# Altium schematic sheet PLWD_TOP_V3.SchDoc
size A4; SheetNumber: 1; SheetTotal: 10
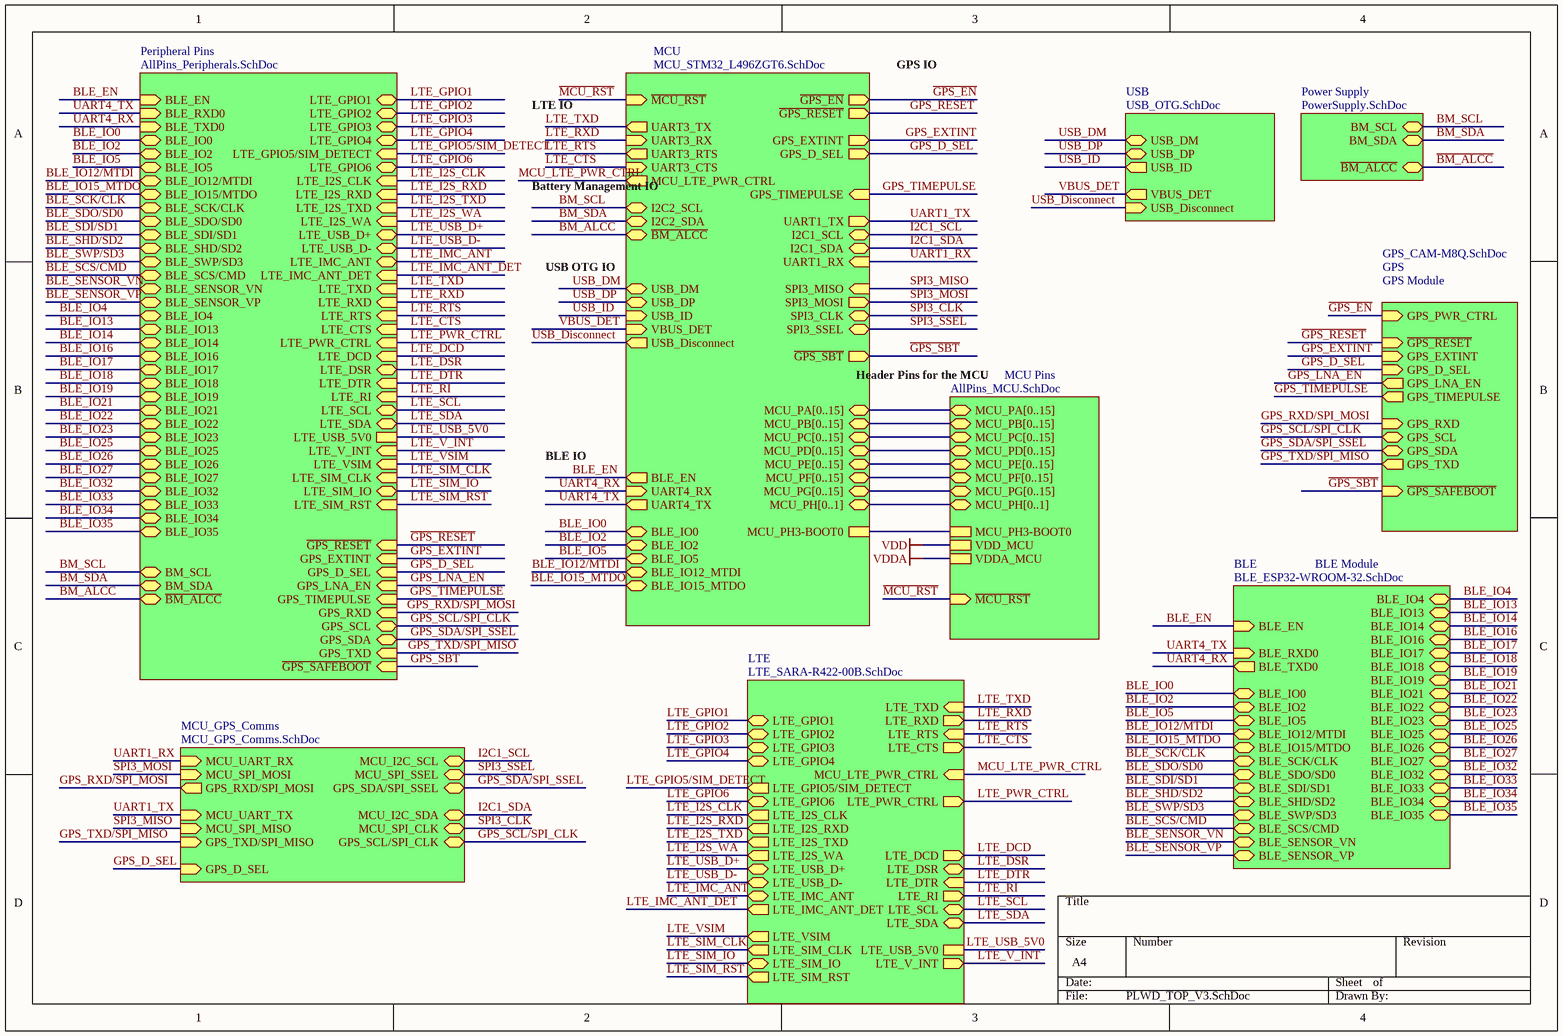
[diagram p0: PLWD_TOP_V3.SchDoc]

## Sub-sheets
BLE = BLE_ESP32-WROOM-32.SchDoc: BLE_EN (in), BLE_RXD0 (in), BLE_TXD0 (out), BLE_IO0 (bidir), BLE_IO2 (bidir), BLE_IO5 (bidir), BLE_IO12/MTDI (bidir), BLE_IO15/MTDO (bidir), BLE_SCK/CLK (bidir), BLE_SDO/SD0 (bidir), BLE_SDI/SD1 (bidir), BLE_SHD/SD2 (bidir), BLE_SWP/SD3 (bidir), BLE_SCS/CMD (bidir), BLE_SENSOR_VN (bidir), BLE_SENSOR_VP (bidir), BLE_IO4 (bidir), BLE_IO13 (bidir), BLE_IO14 (bidir), BLE_IO16 (bidir), BLE_IO17 (bidir), BLE_IO18 (bidir), BLE_IO27 (bidir), BLE_IO26 (bidir), BLE_IO25 (bidir), BLE_IO23 (bidir), BLE_IO22 (bidir), BLE_IO21 (bidir), BLE_IO19 (bidir), BLE_IO32 (bidir), BLE_IO33 (bidir), BLE_IO34 (bidir), BLE_IO35 (bidir)
GPS = GPS_CAM-M8Q.SchDoc: GPS_PWR_CTRL (in), ~{GPS_RESET} (in), GPS_EXTINT (in), GPS_D_SEL (in), GPS_LNA_EN (out), GPS_TIMEPULSE (out), GPS_RXD (in), GPS_SCL (bidir), GPS_SDA (bidir), GPS_TXD (out), ~{GPS_SAFEBOOT} (in)
LTE = LTE_SARA-R422-00B.SchDoc: LTE_TXD (in), LTE_RXD (out), LTE_RTS (in), LTE_CTS (out), MCU_LTE_PWR_CTRL (in), LTE_GPIO1 (bidir), LTE_GPIO2 (bidir), LTE_GPIO3 (bidir), LTE_GPIO4 (bidir), LTE_GPIO5/SIM_DETECT (out), LTE_GPIO6 (bidir), LTE_I2S_CLK (out), LTE_I2S_RXD (out), LTE_I2S_TXD (out), LTE_I2S_WA (out), LTE_USB_D- (bidir), LTE_USB_D+ (bidir), LTE_IMC_ANT (bidir), LTE_IMC_ANT_DET (out), LTE_DTR (in), LTE_DSR (bidir), LTE_DCD (out), LTE_RI (out), LTE_SDA (bidir), LTE_SCL (bidir), LTE_USB_5V0, LTE_V_INT (out), LTE_VSIM (out), LTE_SIM_CLK (out), LTE_SIM_IO (bidir), LTE_SIM_RST (out), LTE_PWR_CTRL (out)
MCU = MCU_STM32_L496ZGT6.SchDoc: UART3_TX (out), UART3_RX (in), UART3_RTS (out), UART3_CTS (in), I2C2_SCL (bidir), I2C2_SDA (bidir), MCU_LTE_PWR_CTRL (out), ~{GPS_SBT} (out), UART1_TX (out), UART1_RX (in), GPS_EXTINT (out), I2C1_SCL (bidir), I2C1_SDA (bidir), GPS_TIMEPULSE (in), GPS_D_SEL (out), UART4_RX (in), UART4_TX (out), BLE_IO0 (bidir), BLE_IO2 (bidir), BLE_IO5 (bidir), BLE_IO12_MTDI (bidir), BLE_IO15_MTDO (bidir), ~{BM_ALCC} (bidir), ~{GPS_RESET} (out), BLE_EN (out), ~{GPS_EN} (out), SPI3_MISO (in), SPI3_MOSI (out), SPI3_CLK (bidir), SPI3_SSEL (bidir), USB_DM (bidir), USB_DP (bidir), MCU_PA[0..15] (bidir), MCU_PB[0..15] (bidir), MCU_PC[0..15] (bidir), MCU_PD[0..15] (bidir), MCU_PE[0..15] (bidir), MCU_PF[0..15] (bidir), MCU_PG[0..15] (bidir), MCU_PH3-BOOT0, MCU_PH[0..1] (bidir), ~{MCU_RST} (in), USB_ID (in), VBUS_DET (in), USB_Disconnect (out)
MCU Pins = AllPins_MCU.SchDoc: MCU_PA[0..15] (bidir), MCU_PB[0..15] (bidir), MCU_PC[0..15] (bidir), MCU_PD[0..15] (bidir), MCU_PE[0..15] (bidir), MCU_PF[0..15] (bidir), MCU_PG[0..15] (bidir), MCU_PH[0..1] (bidir), MCU_PH3-BOOT0, VDD_MCU, VDDA_MCU, ~{MCU_RST} (in)
MCU_GPS_Comms = MCU_GPS_Comms.SchDoc: MCU_UART_RX (in), MCU_SPI_MOSI (in), GPS_D_SEL (in), GPS_RXD/SPI_MOSI (out), MCU_UART_TX (in), MCU_SPI_MISO (in), GPS_TXD/SPI_MISO (in), GPS_SDA/SPI_SSEL (bidir), MCU_SPI_SSEL (bidir), MCU_I2C_SCL (bidir), GPS_SCL/SPI_CLK (bidir), MCU_SPI_CLK (bidir), MCU_I2C_SDA (bidir)
Peripheral Pins = AllPins_Peripherals.SchDoc: BLE_EN (in), BLE_RXD0 (in), BLE_TXD0 (in), BLE_IO0 (bidir), BLE_IO2 (bidir), BLE_IO5 (bidir), BLE_IO12/MTDI (bidir), BLE_IO15/MTDO (bidir), BLE_SCK/CLK (bidir), BLE_SDO/SD0 (bidir), BLE_SDI/SD1 (bidir), BLE_SHD/SD2 (bidir), BLE_SWP/SD3 (bidir), BLE_SCS/CMD (bidir), BLE_SENSOR_VN (bidir), BLE_SENSOR_VP (bidir), BLE_IO4 (bidir), BLE_IO13 (bidir), BLE_IO14 (bidir), BLE_IO16 (bidir), BLE_IO17 (bidir), BLE_IO18 (bidir), BLE_IO19 (bidir), BLE_IO21 (bidir), BLE_IO22 (bidir), BLE_IO23 (bidir), BLE_IO25 (bidir), BLE_IO26 (bidir), BLE_IO27 (bidir), BLE_IO32 (bidir), BLE_IO33 (bidir), BLE_IO34 (bidir), BLE_IO35 (bidir), LTE_IMC_ANT_DET (in), LTE_I2S_RXD (in), LTE_I2S_CLK (in), LTE_GPIO6 (bidir), LTE_GPIO5/SIM_DETECT (in), LTE_GPIO4 (bidir), LTE_GPIO3 (bidir), LTE_GPIO2 (bidir), LTE_GPIO1 (bidir), LTE_I2S_TXD (in), LTE_I2S_WA (in), LTE_USB_D+ (bidir), LTE_USB_D- (bidir), LTE_IMC_ANT (bidir), LTE_TXD (in), LTE_RXD (in), LTE_RTS (in), LTE_CTS (in), LTE_PWR_CTRL (in), LTE_DCD (in), LTE_DSR (bidir), LTE_DTR (in), LTE_RI (in), ~{GPS_RESET} (in), GPS_EXTINT (in), GPS_D_SEL (in), GPS_LNA_EN (in), GPS_TIMEPULSE (in), GPS_RXD (in), GPS_TXD (in), GPS_SCL (bidir), GPS_SDA (bidir), BM_SCL (bidir), BM_SDA (bidir), ~{BM_ALCC} (bidir), ~{GPS_SAFEBOOT} (in), LTE_USB_5V0, LTE_SDA (bidir), LTE_SCL (bidir), LTE_V_INT (in), LTE_SIM_CLK (in), LTE_VSIM (in), LTE_SIM_RST (in), LTE_SIM_IO (bidir)
Power Supply = PowerSupply.SchDoc: BM_SCL (bidir), BM_SDA (bidir), ~{BM_ALCC} (bidir)
USB = USB_OTG.SchDoc: USB_DM (bidir), USB_DP (bidir), USB_ID (out), VBUS_DET (out), USB_Disconnect (in)

## Nets
VDD: sheet MCU Pins/VDD_MCU
VDDA: sheet MCU Pins/VDDA_MCU
~{BM_ALCC}: sheet MCU/~{BM_ALCC}, sheet Power Supply/~{BM_ALCC}, sheet Peripheral Pins/~{BM_ALCC}
BLE_EN: sheet MCU/BLE_EN, sheet BLE/BLE_EN, sheet Peripheral Pins/BLE_EN
BLE_IO0: sheet MCU/BLE_IO0, sheet BLE/BLE_IO0, sheet Peripheral Pins/BLE_IO0
BLE_IO2: sheet MCU/BLE_IO2, sheet BLE/BLE_IO2, sheet Peripheral Pins/BLE_IO2
BLE_IO4: sheet BLE/BLE_IO4, sheet Peripheral Pins/BLE_IO4
BLE_IO5: sheet MCU/BLE_IO5, sheet BLE/BLE_IO5, sheet Peripheral Pins/BLE_IO5
BLE_IO12/MTDI: sheet MCU/BLE_IO12_MTDI, sheet BLE/BLE_IO12/MTDI, sheet Peripheral Pins/BLE_IO12/MTDI
BLE_IO13: sheet BLE/BLE_IO13, sheet Peripheral Pins/BLE_IO13
BLE_IO14: sheet BLE/BLE_IO14, sheet Peripheral Pins/BLE_IO14
BLE_IO15_MTDO: sheet MCU/BLE_IO15_MTDO, sheet BLE/BLE_IO15/MTDO, sheet Peripheral Pins/BLE_IO15/MTDO
BLE_IO16: sheet BLE/BLE_IO16, sheet Peripheral Pins/BLE_IO16
BLE_IO17: sheet BLE/BLE_IO17, sheet Peripheral Pins/BLE_IO17
BLE_IO18: sheet BLE/BLE_IO18, sheet Peripheral Pins/BLE_IO18
BLE_IO19: sheet BLE/BLE_IO19, sheet Peripheral Pins/BLE_IO19
BLE_IO21: sheet BLE/BLE_IO21, sheet Peripheral Pins/BLE_IO21
BLE_IO22: sheet BLE/BLE_IO22, sheet Peripheral Pins/BLE_IO22
BLE_IO23: sheet BLE/BLE_IO23, sheet Peripheral Pins/BLE_IO23
BLE_IO25: sheet BLE/BLE_IO25, sheet Peripheral Pins/BLE_IO25
BLE_IO26: sheet BLE/BLE_IO26, sheet Peripheral Pins/BLE_IO26
BLE_IO27: sheet BLE/BLE_IO27, sheet Peripheral Pins/BLE_IO27
BLE_IO32: sheet BLE/BLE_IO32, sheet Peripheral Pins/BLE_IO32
BLE_IO33: sheet BLE/BLE_IO33, sheet Peripheral Pins/BLE_IO33
BLE_IO34: sheet BLE/BLE_IO34, sheet Peripheral Pins/BLE_IO34
BLE_IO35: sheet BLE/BLE_IO35, sheet Peripheral Pins/BLE_IO35
BLE_SCK/CLK: sheet BLE/BLE_SCK/CLK, sheet Peripheral Pins/BLE_SCK/CLK
BLE_SCS/CMD: sheet BLE/BLE_SCS/CMD, sheet Peripheral Pins/BLE_SCS/CMD
BLE_SDI/SD1: sheet BLE/BLE_SDI/SD1, sheet Peripheral Pins/BLE_SDI/SD1
BLE_SDO/SD0: sheet BLE/BLE_SDO/SD0, sheet Peripheral Pins/BLE_SDO/SD0
BLE_SENSOR_VN: sheet BLE/BLE_SENSOR_VN, sheet Peripheral Pins/BLE_SENSOR_VN
BLE_SENSOR_VP: sheet BLE/BLE_SENSOR_VP, sheet Peripheral Pins/BLE_SENSOR_VP
BLE_SHD/SD2: sheet BLE/BLE_SHD/SD2, sheet Peripheral Pins/BLE_SHD/SD2
BLE_SWP/SD3: sheet BLE/BLE_SWP/SD3, sheet Peripheral Pins/BLE_SWP/SD3
BM_SCL: sheet MCU/I2C2_SCL, sheet Power Supply/BM_SCL, sheet Peripheral Pins/BM_SCL
BM_SDA: sheet MCU/I2C2_SDA, sheet Power Supply/BM_SDA, sheet Peripheral Pins/BM_SDA
~{GPS_EN}: sheet MCU/~{GPS_EN}, sheet GPS/GPS_PWR_CTRL
~{GPS_RESET}: sheet MCU/~{GPS_RESET}, sheet GPS/~{GPS_RESET}, sheet Peripheral Pins/~{GPS_RESET}
~{GPS_SBT}: sheet MCU/~{GPS_SBT}, sheet GPS/~{GPS_SAFEBOOT}, sheet Peripheral Pins/~{GPS_SAFEBOOT}
GPS_D_SEL: sheet MCU/GPS_D_SEL, sheet GPS/GPS_D_SEL, sheet Peripheral Pins/GPS_D_SEL, sheet MCU_GPS_Comms/GPS_D_SEL
GPS_EXTINT: sheet MCU/GPS_EXTINT, sheet GPS/GPS_EXTINT, sheet Peripheral Pins/GPS_EXTINT
GPS_LNA_EN: sheet GPS/GPS_LNA_EN, sheet Peripheral Pins/GPS_LNA_EN
GPS_RXD/SPI_MOSI: sheet GPS/GPS_RXD, sheet Peripheral Pins/GPS_RXD, sheet MCU_GPS_Comms/GPS_RXD/SPI_MOSI
GPS_SCL/SPI_CLK: sheet GPS/GPS_SCL, sheet Peripheral Pins/GPS_SCL, sheet MCU_GPS_Comms/GPS_SCL/SPI_CLK
GPS_SDA/SPI_SSEL: sheet GPS/GPS_SDA, sheet Peripheral Pins/GPS_SDA, sheet MCU_GPS_Comms/GPS_SDA/SPI_SSEL
GPS_TIMEPULSE: sheet MCU/GPS_TIMEPULSE, sheet GPS/GPS_TIMEPULSE, sheet Peripheral Pins/GPS_TIMEPULSE
GPS_TXD/SPI_MISO: sheet GPS/GPS_TXD, sheet Peripheral Pins/GPS_TXD, sheet MCU_GPS_Comms/GPS_TXD/SPI_MISO
I2C1_SCL: sheet MCU/I2C1_SCL, sheet MCU_GPS_Comms/MCU_I2C_SCL
I2C1_SDA: sheet MCU/I2C1_SDA, sheet MCU_GPS_Comms/MCU_I2C_SDA
LTE_CTS: sheet MCU/UART3_CTS, sheet LTE/LTE_CTS, sheet Peripheral Pins/LTE_CTS
LTE_DCD: sheet LTE/LTE_DCD, sheet Peripheral Pins/LTE_DCD
LTE_DSR: sheet LTE/LTE_DSR, sheet Peripheral Pins/LTE_DSR
LTE_DTR: sheet LTE/LTE_DTR, sheet Peripheral Pins/LTE_DTR
LTE_GPIO1: sheet LTE/LTE_GPIO1, sheet Peripheral Pins/LTE_GPIO1
LTE_GPIO2: sheet LTE/LTE_GPIO2, sheet Peripheral Pins/LTE_GPIO2
LTE_GPIO3: sheet LTE/LTE_GPIO3, sheet Peripheral Pins/LTE_GPIO3
LTE_GPIO4: sheet LTE/LTE_GPIO4, sheet Peripheral Pins/LTE_GPIO4
LTE_GPIO5/SIM_DETECT: sheet LTE/LTE_GPIO5/SIM_DETECT, sheet Peripheral Pins/LTE_GPIO5/SIM_DETECT
LTE_GPIO6: sheet LTE/LTE_GPIO6, sheet Peripheral Pins/LTE_GPIO6
LTE_I2S_CLK: sheet LTE/LTE_I2S_CLK, sheet Peripheral Pins/LTE_I2S_CLK
LTE_I2S_RXD: sheet LTE/LTE_I2S_RXD, sheet Peripheral Pins/LTE_I2S_RXD
LTE_I2S_TXD: sheet LTE/LTE_I2S_TXD, sheet Peripheral Pins/LTE_I2S_TXD
LTE_I2S_WA: sheet LTE/LTE_I2S_WA, sheet Peripheral Pins/LTE_I2S_WA
LTE_IMC_ANT: sheet LTE/LTE_IMC_ANT, sheet Peripheral Pins/LTE_IMC_ANT
LTE_IMC_ANT_DET: sheet LTE/LTE_IMC_ANT_DET, sheet Peripheral Pins/LTE_IMC_ANT_DET
LTE_PWR_CTRL: sheet LTE/LTE_PWR_CTRL, sheet Peripheral Pins/LTE_PWR_CTRL
LTE_RI: sheet LTE/LTE_RI, sheet Peripheral Pins/LTE_RI
LTE_RTS: sheet MCU/UART3_RTS, sheet LTE/LTE_RTS, sheet Peripheral Pins/LTE_RTS
LTE_RXD: sheet MCU/UART3_RX, sheet LTE/LTE_RXD, sheet Peripheral Pins/LTE_RXD
LTE_SCL: sheet LTE/LTE_SCL, sheet Peripheral Pins/LTE_SCL
LTE_SDA: sheet LTE/LTE_SDA, sheet Peripheral Pins/LTE_SDA
LTE_SIM_CLK: sheet LTE/LTE_SIM_CLK, sheet Peripheral Pins/LTE_SIM_CLK
LTE_SIM_IO: sheet LTE/LTE_SIM_IO, sheet Peripheral Pins/LTE_SIM_IO
LTE_SIM_RST: sheet LTE/LTE_SIM_RST, sheet Peripheral Pins/LTE_SIM_RST
LTE_TXD: sheet MCU/UART3_TX, sheet LTE/LTE_TXD, sheet Peripheral Pins/LTE_TXD
LTE_USB_5V0: sheet LTE/LTE_USB_5V0, sheet Peripheral Pins/LTE_USB_5V0
LTE_USB_D+: sheet LTE/LTE_USB_D+, sheet Peripheral Pins/LTE_USB_D+
LTE_USB_D-: sheet LTE/LTE_USB_D-, sheet Peripheral Pins/LTE_USB_D-
LTE_V_INT: sheet LTE/LTE_V_INT, sheet Peripheral Pins/LTE_V_INT
LTE_VSIM: sheet LTE/LTE_VSIM, sheet Peripheral Pins/LTE_VSIM
~{MCU_RST}: sheet MCU/~{MCU_RST}, sheet MCU Pins/~{MCU_RST}
MCU_LTE_PWR_CTRL: sheet MCU/MCU_LTE_PWR_CTRL, sheet LTE/MCU_LTE_PWR_CTRL
SPI3_CLK: sheet MCU/SPI3_CLK, sheet MCU_GPS_Comms/MCU_SPI_CLK
SPI3_MISO: sheet MCU/SPI3_MISO, sheet MCU_GPS_Comms/MCU_SPI_MISO
SPI3_MOSI: sheet MCU/SPI3_MOSI, sheet MCU_GPS_Comms/MCU_SPI_MOSI
SPI3_SSEL: sheet MCU/SPI3_SSEL, sheet MCU_GPS_Comms/MCU_SPI_SSEL
UART1_RX: sheet MCU/UART1_RX, sheet MCU_GPS_Comms/MCU_UART_RX
UART1_TX: sheet MCU/UART1_TX, sheet MCU_GPS_Comms/MCU_UART_TX
UART4_RX: sheet MCU/UART4_RX, sheet BLE/BLE_TXD0, sheet Peripheral Pins/BLE_TXD0
UART4_TX: sheet MCU/UART4_TX, sheet BLE/BLE_RXD0, sheet Peripheral Pins/BLE_RXD0
USB_Disconnect: sheet MCU/USB_Disconnect, sheet USB/USB_Disconnect
USB_DM: sheet MCU/USB_DM, sheet USB/USB_DM
USB_DP: sheet MCU/USB_DP, sheet USB/USB_DP
USB_ID: sheet MCU/USB_ID, sheet USB/USB_ID
VBUS_DET: sheet MCU/VBUS_DET, sheet USB/VBUS_DET
(unnamed): sheet MCU/MCU_PH3-BOOT0, sheet MCU Pins/MCU_PH3-BOOT0

## Buses and harness runs
bus sheet MCU Pins/MCU_PA[0..15] = sheet MCU/MCU_PA[0..15]
bus sheet MCU Pins/MCU_PB[0..15] = sheet MCU/MCU_PB[0..15]
bus sheet MCU Pins/MCU_PC[0..15] = sheet MCU/MCU_PC[0..15]
bus sheet MCU Pins/MCU_PD[0..15] = sheet MCU/MCU_PD[0..15]
bus sheet MCU Pins/MCU_PE[0..15] = sheet MCU/MCU_PE[0..15]
bus sheet MCU Pins/MCU_PF[0..15] = sheet MCU/MCU_PF[0..15]
bus sheet MCU Pins/MCU_PG[0..15] = sheet MCU/MCU_PG[0..15]
bus sheet MCU Pins/MCU_PH[0..1] = sheet MCU/MCU_PH[0..1]

## Notes on the sheet
- LTE IO
- GPS IO
- Battery Management IO
- USB OTG IO
- GPS Module
- Header Pins for the MCU
- BLE IO
- BLE Module